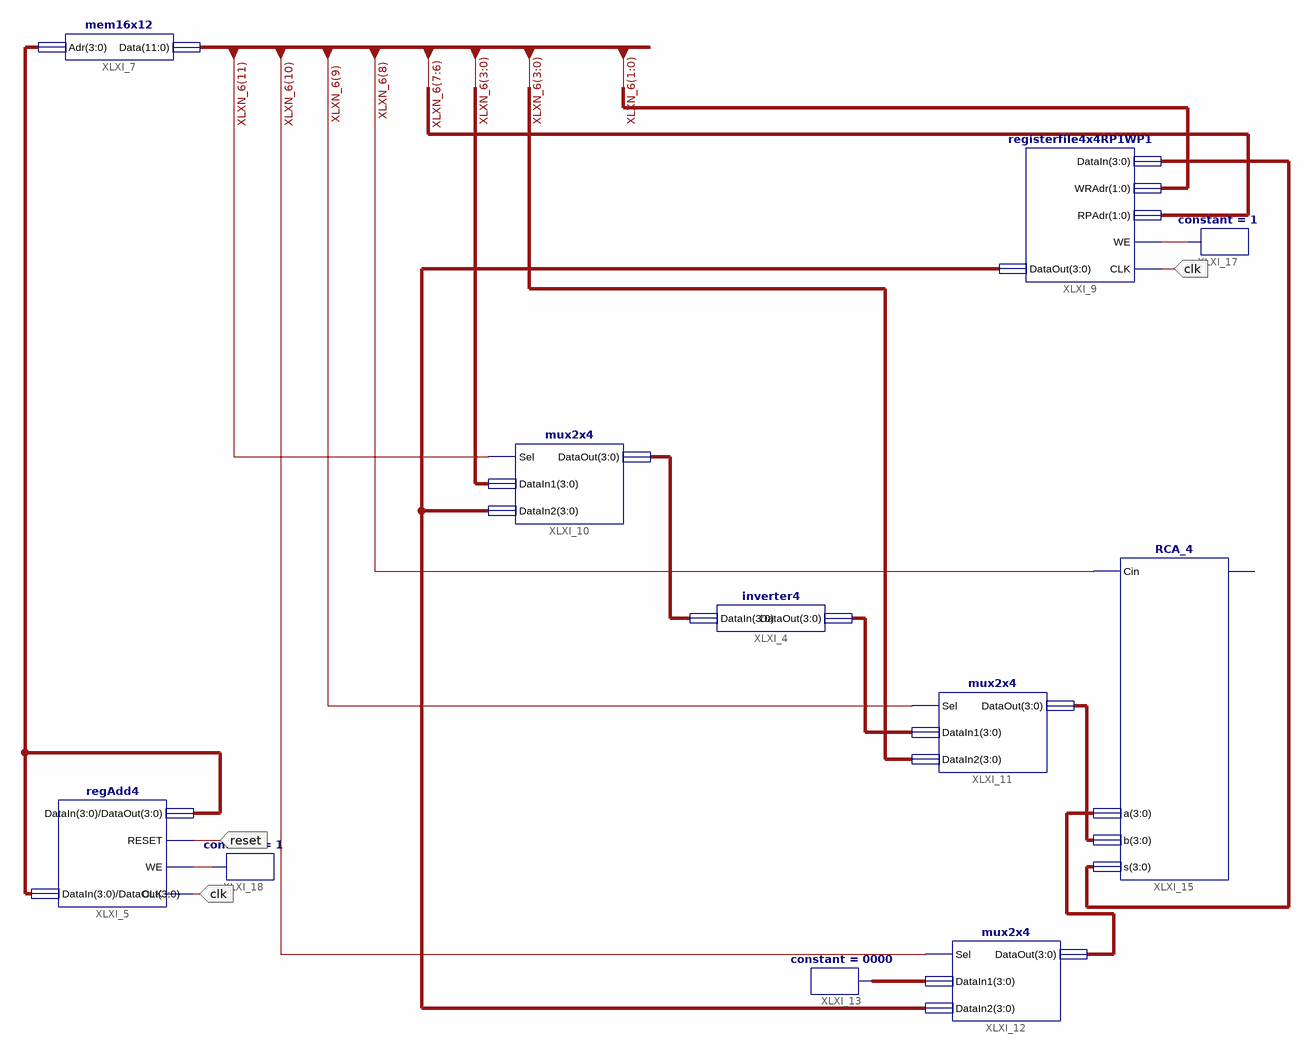
[diagram p0: schematic sheet 1]
// Xilinx ISE schematic Rechner.sch (spartan3e) as structural Verilog: 11 symbols, 2 ports
module Rechner (
  input  clk,
  input  reset
);

  wire XLXN_45, XLXN_48;
  wire [3:0] XLXN_4, XLXN_5, XLXN_9, XLXN_15, XLXN_19, XLXN_35, XLXN_37, XLXN_38;
  wire [11:0] XLXN_6;

  inverter4 XLXI_4 (.DataIn(XLXN_5), .DataOut(XLXN_4));
  regAdd4 XLXI_5 (.CLK(clk), .WE(XLXN_48), .RESET(reset), .DataIn(XLXN_9), .DataOut(XLXN_9));
  mem16x12 #(.FileName("prom.txt")) XLXI_7 (.Adr(XLXN_9), .Data(XLXN_6));
  registerfile4x4RP1WP1 XLXI_9 (
    .CLK(clk), .WE(XLXN_45), .RPAdr(XLXN_6[7:6]), .WRAdr(XLXN_6[1:0]), .DataIn(XLXN_35), .DataOut(XLXN_19));
  mux2x4 XLXI_10 (.Sel(XLXN_6[11]), .DataIn1(XLXN_6[3:0]), .DataIn2(XLXN_19), .DataOut(XLXN_5));
  mux2x4 XLXI_11 (.Sel(XLXN_6[9]), .DataIn1(XLXN_4), .DataIn2(XLXN_6[3:0]), .DataOut(XLXN_37));
  mux2x4 XLXI_12 (.Sel(XLXN_6[10]), .DataIn1(XLXN_15), .DataIn2(XLXN_19), .DataOut(XLXN_38));
  constant #(.CValue("0000")) XLXI_13 (.O(XLXN_15));
  RCA_4 XLXI_15 (.Cin(XLXN_6[8]), .a(XLXN_38), .b(XLXN_37), .s(XLXN_35));  // open: Cout
  constant #(.CValue("1")) XLXI_17 (.O(XLXN_45));
  constant #(.CValue("1")) XLXI_18 (.O(XLXN_48));
endmodule
